# EAGLE schematic QRD1114_lista (EAGLE 9.0.1)
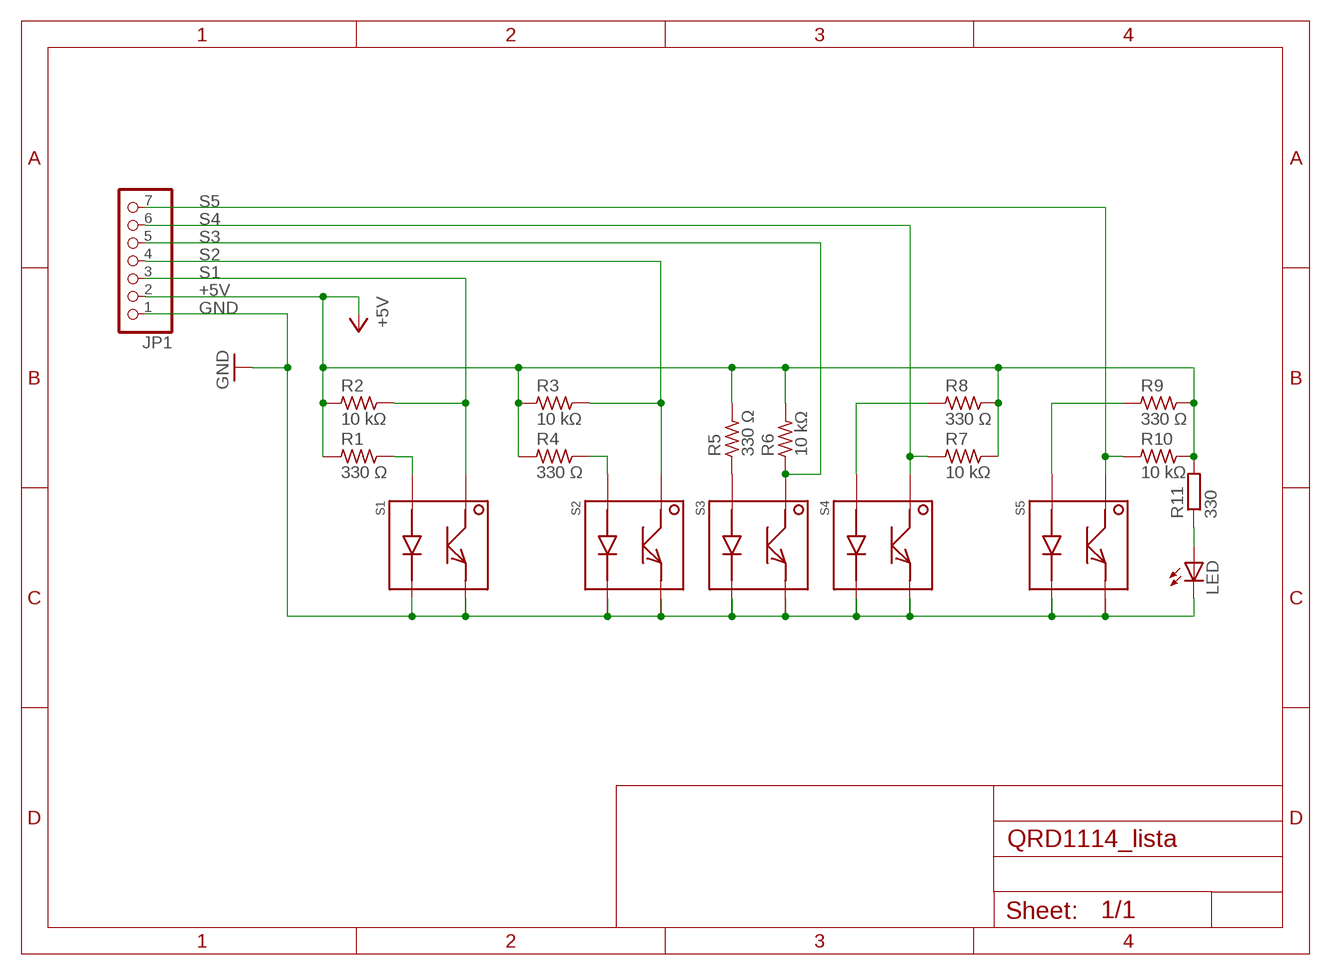
[diagram p0: schematic, sheet 1]

## Parts
JP1  PINHD-1X7  [1X07]
LED  LEDCHIPLED-0603-TTW  [CHIPLED-0603-TTW]
R1  330 Ω  R_0603  [R0603]
R2  10 kΩ  R_0603  [R0603]
R3  10 kΩ  R_0603  [R0603]
R4  330 Ω  R_0603  [R0603]
R5  330 Ω  R_0603  [R0603]
R6  10 kΩ  R_0603  [R0603]
R7  10 kΩ  R_0603  [R0603]
R8  330 Ω  R_0603  [R0603]
R9  330 Ω  R_0603  [R0603]
R10  10 kΩ  R_0603  [R0603]
R11  330  R-EU_R0805  [R0805]
S1  QRD1114  [QRD1114]
S2  QRD1114  [QRD1114]
S3  QRD1114  [QRD1114]
S4  QRD1114  [QRD1114]
S5  QRD1114  [QRD1114]

## Nets
+5V: JP1.2 R1.1 R2.1 R3.1 R4.1 R5.2 R6.2 R7.2 R8.2 R9.2 R10.2 R11.2
GND: JP1.1 LED.C@1(C) S1.P$2 S1.P$4 S2.P$2 S2.P$4 S3.P$2 S3.P$4 S4.P$2 S4.P$4 S5.P$2 S5.P$4
N$1: R5.1 S3.P$3
N$2: R1.2 S1.P$3
N$3: LED.A@1(A) R11.1
N$4: R8.1 S4.P$3
N$5: R4.2 S2.P$3
N$7: R9.1 S5.P$3
S1: JP1.3 R2.2 S1.P$1
S2: JP1.4 R3.2 S2.P$1
S3: JP1.5 R6.1 S3.P$1
S4: JP1.6 R7.1 S4.P$1
S5: JP1.7 R10.1 S5.P$1

## Library data of the parts
JP1 = pinhead:PINHD-1X7: PIN HEADER
LED = led:LED: LED OSRAM: - CHIPLED LG R971, LG N971, LY N971, LG Q971, LY Q971, LO R971, LY R971 LH N974, LH R974 LS Q976, LO Q976, LY Q976 LO Q996 - Hyper CHIPLED LW Q18S LB Q993, LB Q99A, LB R99A - SideLED LS A670, LO A670, LY A670, LG A670, LP A670 LB A673, LV A673, LT A673, LW A673 LH A674 LY A675 LS A676, LA A676, LO A676, LY A676, LW A676 LS A679, LY A679, LG A679 - Hyper Micro SIDELED® LS Y876, LA Y876, LO Y876, LY Y876 LT Y87S - SmartLED LW L88C, LW L88S LB L89C, LB L89S, LG L890 LS L89K, LO L89K, LY L89K LS L896, LA L896, LO L896, LY L896 - TOPLED LS T670, LO T670, LY T670, LG T670, LP T670 LSG T670, LSP T670, LSY T670, LOP T670, LYG T670 LG T671, LOG T671, LSG T671 LB T673, LV T673, LT T673, LW T673 LH T674 LS T676, LA T676, LO T676, LY T676, LB T676, LH T676, LSB T676, LW T676 LB T67C, LV T67C, LT T67C, LS T67K, LO T67K, LY T67K, LW E67C LS E67B, LA E67B, LO E67B, LY E67B, LB E67C, LV E67C, LT E67C LW T67C LS T679, LY T679, LG T679 LS T770, LO T770, LY T770, LG T770, LP T770 LB T773, LV T773, LT T773, LW T773 LH T774 LS E675, LA E675, LY E675, LS T675 LS T776, LA T776, LO T776, LY T776, LB T776 LHGB T686 LT T68C, LB T68C - Hyper Mini TOPLED® LB M676 - Mini TOPLED Santana® LG M470 LS M47K, LO M47K, LY M47K Source: http://www.osram.convergy.de LUXEON: - LUMILED® LXK2-PW12-R00, LXK2-PW12-S00, LXK2-PW14-U00, LXK2-PW14-V00 LXK2-PM12-R00, LXK2-PM12-S00, LXK2-PM14-U00 LXK2-PE12-Q00, LXK2-PE12-R00, LXK2-PE12-S00, LXK2-PE14-T00, LXK2-PE14-U00 LXK2-PB12-K00, LXK2-PB12-L00, LXK2-PB12-M00, LXK2-PB14-N00, LXK2-PB14-P00, LXK2-PB14-Q00 LXK2-PR12-L00, LXK2-PR12-M00, LXK2-PR14-Q00, LXK2-PR14-R00 LXK2-PD12-Q00, LXK2-PD12-R00, LXK2-PD12-S00 LXK2-PH12-R00, LXK2-PH12-S00 LXK2-PL12-P00, LXK2-PL12-Q00, LXK2-PL12-R00 Source: www.luxeon.com KINGBRIGHT: KA-3528ASYC Source: www.kingbright.com
R1 R4 R5 R8 R9 = rc-master-smd:R_: RESISTOR; MF: VISHAY; MPN: CRCW0805330RFKEA; OC_FARNELL: 1469918
R2 R3 R6 R7 R10 = rc-master-smd:R_: RESISTOR; OC_FARNELL: unknown
R11 = resistor:R-EU_: RESISTOR, European symbol
S1-S4 = QRD1114:QRD1114; AVAILABILITY: Good; DESCRIPTION: QRD1114 Series 30 V 50 mA Phototransistor Reflective Object Sensor; MF: ON SEMICONDUCTOR; MP: QRD1114; MPN: QRD1114; OC_FARNELL: 1467858; PACKAGE: Radial-4 ON Semiconductor; PRICE: 0.97 USD
S5 = QRD1114:QRD1114; AVAILABILITY: Good; DESCRIPTION: QRD1114 Series 30 V 50 mA Phototransistor Reflective Object Sensor; MF: ON Semiconductor; MP: QRD1114; MPN: QRD1114; OC_FARNELL: 1467858; PACKAGE: Radial-4 ON Semiconductor; PRICE: 0.97 USD

## Net classes
0 default: width 0.254 mm, drill 0.254 mm, clearance 0.254 mm